# Altium schematic sheet EXP03_2307_20232241110.SchDoc: 晶体管共射极单管放大电路
size A4 portrait; PageSetup: Record=PageOptions|CenterHorizontal=True|CenterVertical=True|PrintScale=0.71|XCorrection=1.00|YCorrection=1.00|PrintKind=0|BorderSize=5000000|LeftOffset=0|BottomOffset=0|Orientation=2|PaperLength=1000|PaperWidth=1000|Scale=100|PaperSource=7|PrintQuality=-4|MediaType=1|DitherType=10|PaperKind=A4|PrintScaleMode=1
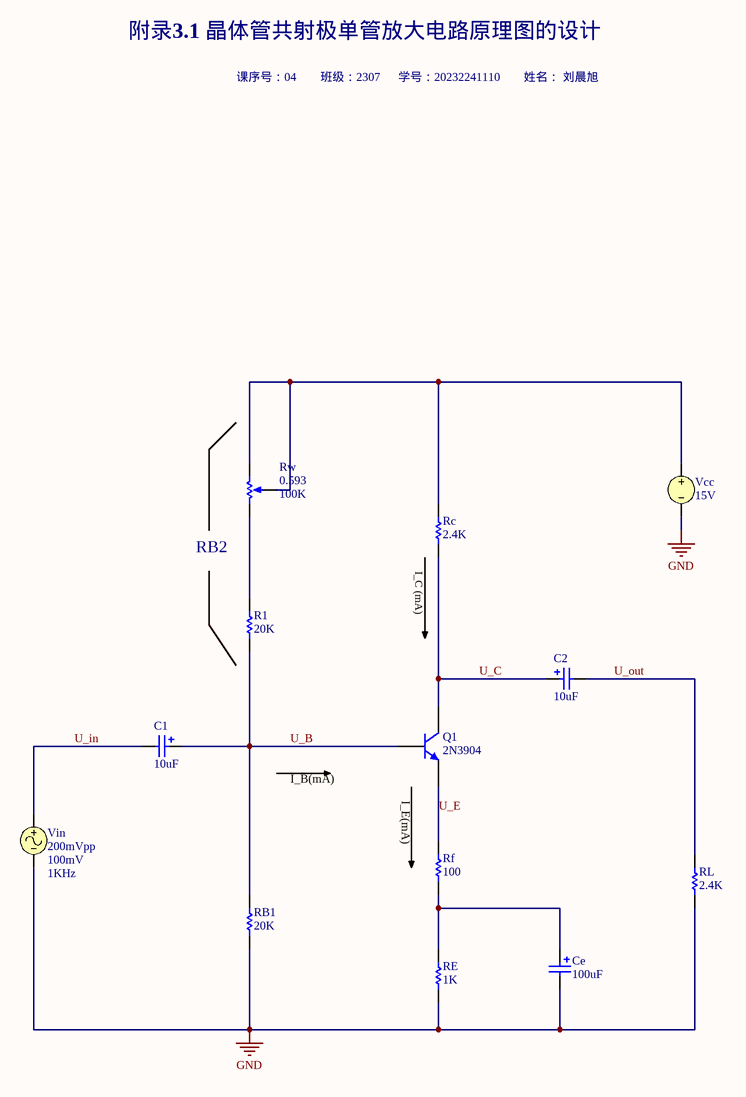
[diagram p0: EXP03_2307_20232241110.SchDoc]

## Parts
C1  value 10uF  [POLAR0.8]  (hidden comment: Cap Pol2)
C2  value 10uF  [POLAR0.8]  (hidden comment: Cap Pol2)
Ce  value 100uF  [POLAR0.8]  (hidden comment: Cap Pol2)
Q1  2N3904  [TO-92A]
R1  value 20K  [AXIAL-0.3]  (hidden comment: Res1)
RB1  value 20K  [AXIAL-0.3]  (hidden comment: Res1)
Rc  value 2.4K  [AXIAL-0.3]  (hidden comment: Res1)
RE  value 1K  [AXIAL-0.3]  (hidden comment: Res1)
Rf  value 100  [AXIAL-0.3]  (hidden comment: Res1)
RL  value 2.4K  [AXIAL-0.3]  (hidden comment: Res1)
Rw  value 100K  Set Position: 0.593  [VR5]  (hidden comment: RPot)
Vcc  value 15V  (hidden comment: VSRC)
Vin  200mVpp  Amplitude: 100mV  Frequency: 1KHz

## Nets
GND: Ce.2 RB1.1 RE.1 RL.1 Vcc.2 Vin.2
U_B: C1.1 Q1.2(B) R1.1 RB1.2
U_C: C2.1 Q1.3(C) Rc.1
U_E: Q1.1(E) Rf.2
U_in: C1.2 Vin.1
U_out: C2.2 RL.2
NetCe_1: Ce.1 RE.2 Rf.1
NetR1_2: R1.2 Rw.2(BOT)
NetRc_2: Rc.2 Rw.1(TOP) Rw.3(TAP) Vcc.1

## Notes on the sheet
- 附录3.1 晶体管共射极单管放大电路原理图的设计
- 课序号：04        班级：2307      学号：20232241110        姓名： 刘晨旭
- RB2
- (near Rc) I_C (mA)
- I_B(mA)
- I_E(mA)

## Library data of the parts
C1 C2 Ce = Cap Pol2: Polarized Capacitor (Axial); Published: 8-Jun-2000; LatestRevisionDate: 17-Jul-2002; LatestRevisionNote: Re-released for DXP Platform.; PackageReference: POLAR0.8; Publisher: Altium Limited
Q1 = 2N3904: NPN General Purpose Amplifier; Published: 8-Jun-2000; LatestRevisionDate: 15-Jan-2003; LatestRevisionNote: PCB Footprint 'BCY-W3/D4.7' replaced; DatasheetDocument: 1997; PackageDocument: Sep-1998; PackageReference: TO-92A; Publisher: Altium Limited; Code_JEDEC: TO-92A; ComponentLink1Description: Manufacturer Link; ComponentLink1URL: http://www.fairchildsemi.com/; ComponentLink2Description: Datasheet; ComponentLink2URL: http://www.fairchildsemi.com/ds/2N%2F2N3904.pdf
R1 RB1 Rc RE Rf RL = Res1: Resistor; Published: 8-Jun-2000; LatestRevisionDate: 17-Jul-2002; LatestRevisionNote: Re-released for DXP Platform.; PackageReference: AXIAL-0.3; Publisher: Altium Limited
Rw = RPot: Potentiometer; Sim Note: Enter the Resistance value and the set point into parameter fields.; Published: 8-Jun-2000; LatestRevisionDate: 17-Jul-2002; LatestRevisionNote: Re-released for DXP Platform.; PackageReference: VR5; Publisher: Altium Limited
Vcc = VSRC: Voltage Source; Note: PCB Footprint - Not required; Published: 8-Jun-2000; LatestRevisionDate: 17-Jul-2002; LatestRevisionNote: Re-released for DXP Platform.; PackageReference: Not Applicable; Publisher: Altium Limited
Vin = VSIN: Sinusoidal Voltage Source; Note: PCB Footprint - Not required; Published: 8-Jun-2000; LatestRevisionDate: 15-Nov-2004; LatestRevisionNote: Corrected Netlist.; PackageReference: Not Applicable; Publisher: Altium Limited